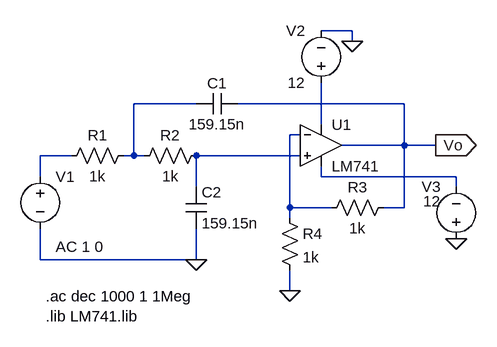
[diagram p0: schematic q5.asc]
q5.asc, the LTspice schematic file:
Version 4
SHEET 1 880 680
WIRE 528 -176 480 -176
WIRE 528 -160 528 -176
WIRE 288 -64 192 -64
WIRE 608 -64 352 -64
WIRE 480 -32 480 -96
WIRE 448 -16 432 -16
WIRE 608 0 608 -64
WIRE 608 0 512 0
WIRE 656 0 608 0
WIRE 96 16 48 16
WIRE 192 16 192 -64
WIRE 192 16 176 16
WIRE 208 16 192 16
WIRE 448 16 288 16
WIRE 48 48 48 16
WIRE 480 48 480 32
WIRE 688 48 480 48
WIRE 288 64 288 16
WIRE 688 64 688 48
WIRE 432 96 432 -16
WIRE 496 96 432 96
WIRE 608 96 608 0
WIRE 608 96 576 96
WIRE 432 112 432 96
WIRE 48 176 48 128
WIRE 288 176 288 128
WIRE 288 176 48 176
WIRE 432 224 432 192
FLAG 288 176 0
FLAG 432 224 0
FLAG 656 0 Vo
IOPIN 656 0 Out
FLAG 688 144 0
FLAG 528 -160 0
SYMBOL voltage 48 32 R0
WINDOW 123 24 124 Left 2
WINDOW 39 0 0 Left 0
SYMATTR Value2 AC 1 0
SYMATTR InstName V1
SYMATTR Value ""
SYMBOL res 192 0 R90
WINDOW 0 0 56 VBottom 2
WINDOW 3 32 56 VTop 2
SYMATTR InstName R1
SYMATTR Value 1k
SYMBOL res 304 0 R90
WINDOW 0 0 56 VBottom 2
WINDOW 3 32 56 VTop 2
SYMATTR InstName R2
SYMATTR Value 1k
SYMBOL cap 352 -80 R90
WINDOW 0 0 32 VBottom 2
WINDOW 3 32 32 VTop 2
SYMATTR InstName C1
SYMATTR Value 159.15n
SYMBOL cap 272 64 R0
SYMATTR InstName C2
SYMATTR Value 159.15n
SYMBOL res 592 80 R90
WINDOW 0 0 56 VBottom 2
WINDOW 3 32 56 VTop 2
SYMATTR InstName R3
SYMATTR Value 1k
SYMBOL res 416 96 R0
SYMATTR InstName R4
SYMATTR Value 1k
SYMBOL LM741 480 -64 R0
SYMATTR InstName U1
SYMBOL voltage 480 -80 R180
WINDOW 0 24 96 Left 2
WINDOW 3 24 16 Left 2
SYMATTR InstName V2
SYMATTR Value 12
SYMBOL voltage 688 160 R180
WINDOW 0 24 96 Left 2
WINDOW 3 24 74 Left 2
SYMATTR InstName V3
SYMATTR Value 12
TEXT 56 232 Left 2 !.ac dec 1000 1 1Meg\n.lib LM741.lib

The netlist it stands for:
* q5.asc
V1 N004 0 AC 1 0
R1 N001 N004 1k
R2 N005 N001 1k
C1 Vo N001 159.15n
C2 N005 0 159.15n
R3 Vo N003 1k
R4 N003 0 1k
XU1 N005 N003 N002 N006 Vo LM741  ; pins In+ In- V+ V- OUT
V2 N002 0 12
V3 0 N006 12
.ac dec 1000 1 1Meg
.lib LM741.lib
.lib LM741.lib
.backanno
.end